# EAGLE design M709B (EAGLE 6.6.0)
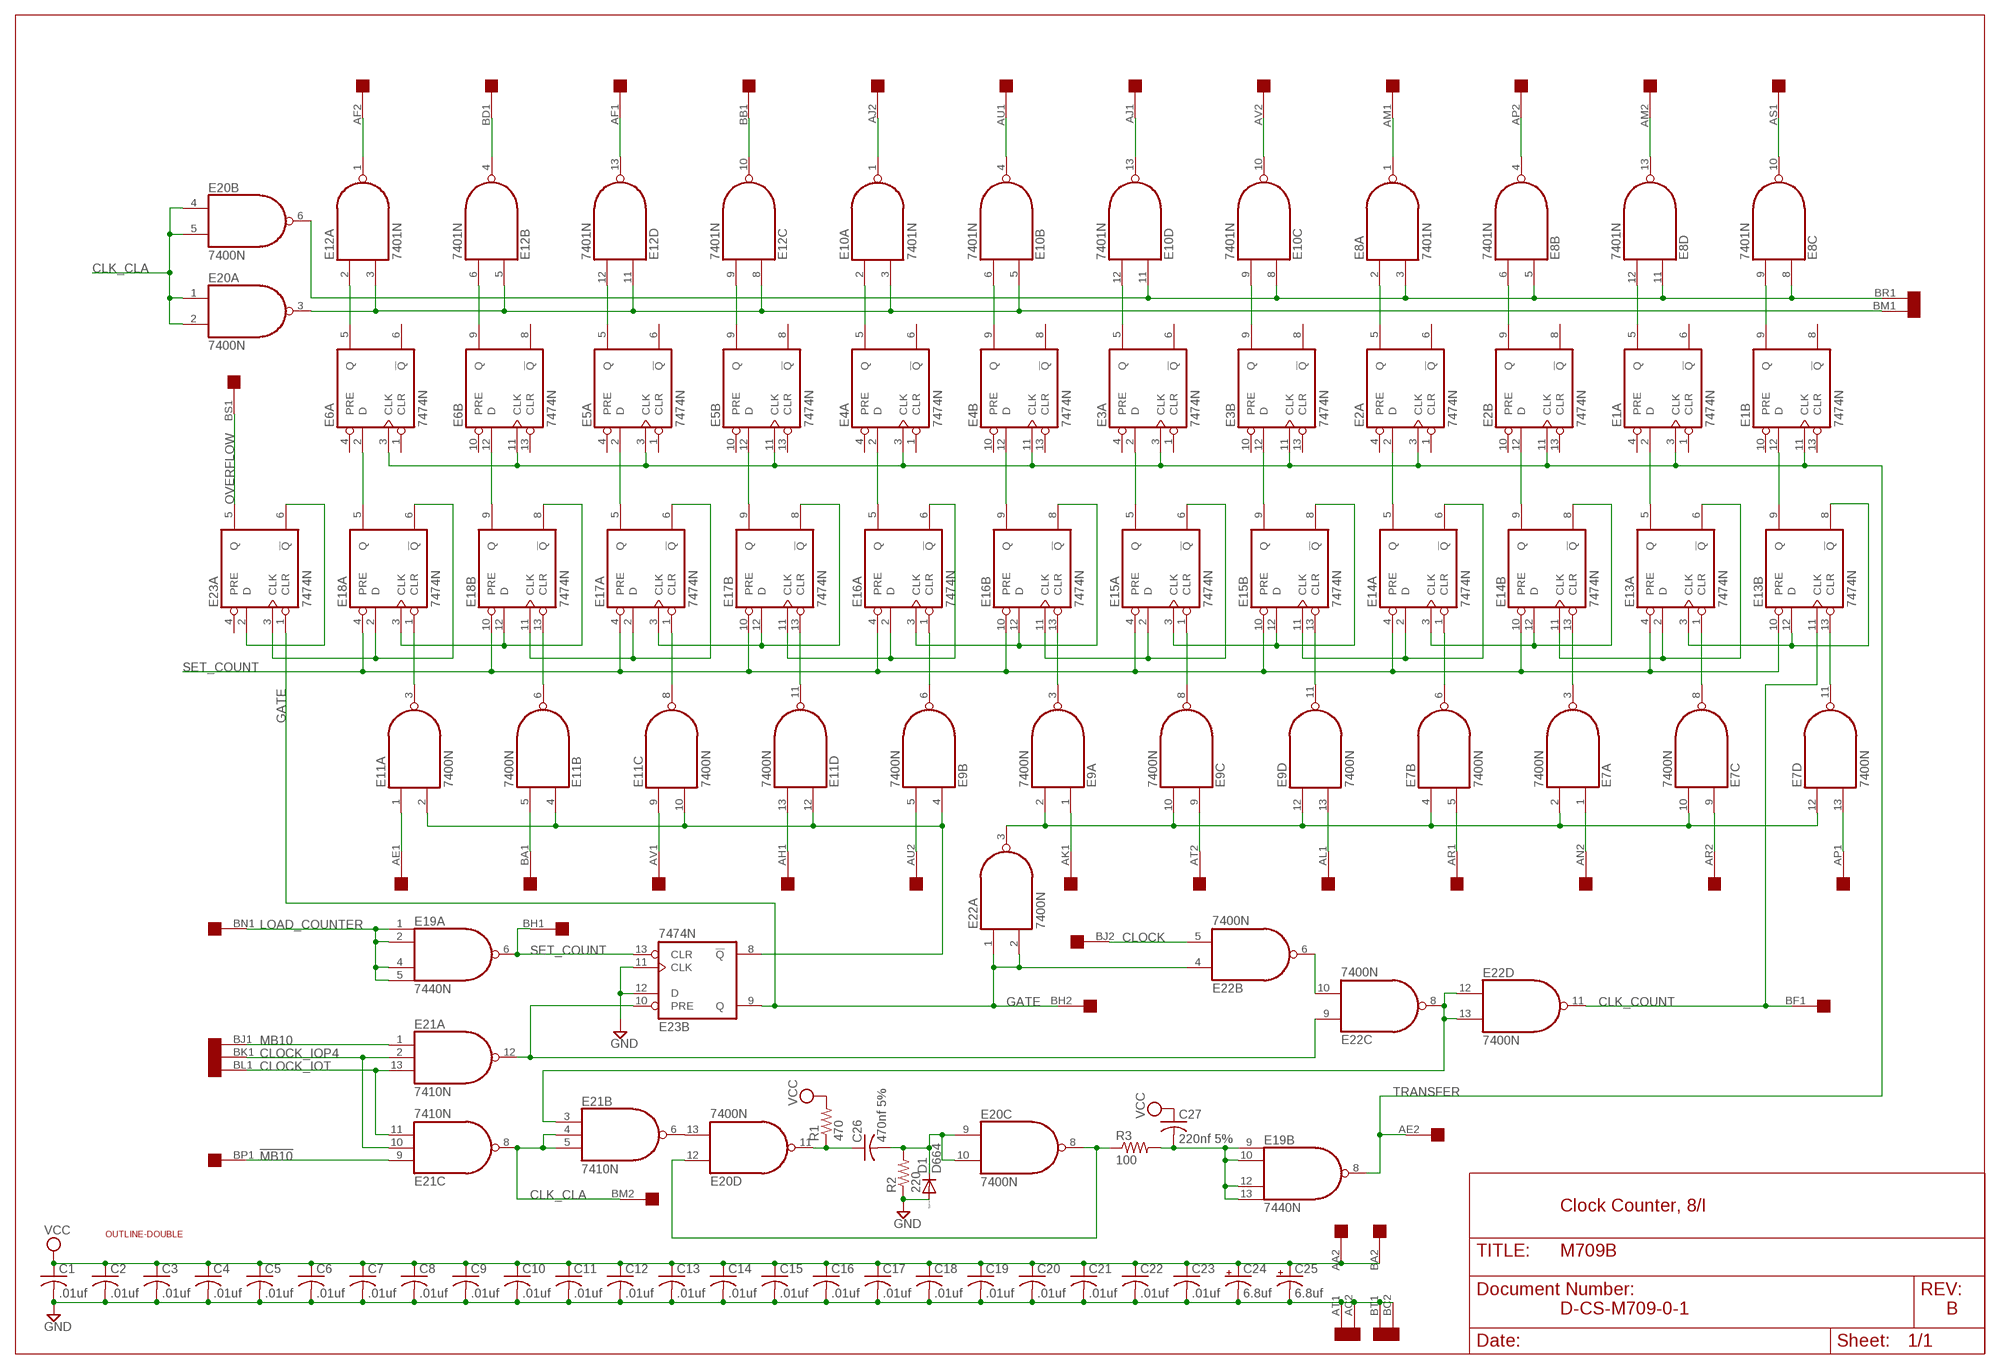
[diagram p0: schematic, sheet 1]

## Parts
C1  .01uf  C-US050-025X075  [C050-025X075]
C2  .01uf  C-US050-025X075  [C050-025X075]
C3  .01uf  C-US050-025X075  [C050-025X075]
C4  .01uf  C-US050-025X075  [C050-025X075]
C5  .01uf  C-US050-025X075  [C050-025X075]
C6  .01uf  C-US050-025X075  [C050-025X075]
C7  .01uf  C-US050-025X075  [C050-025X075]
C8  .01uf  C-US050-025X075  [C050-025X075]
C9  .01uf  C-US050-025X075  [C050-025X075]
C10  .01uf  C-US050-025X075  [C050-025X075]
C11  .01uf  C-US050-025X075  [C050-025X075]
C12  .01uf  C-US050-025X075  [C050-025X075]
C13  .01uf  C-US050-025X075  [C050-025X075]
C14  .01uf  C-US050-025X075  [C050-025X075]
C15  .01uf  C-US050-025X075  [C050-025X075]
C16  .01uf  C-US050-025X075  [C050-025X075]
C17  .01uf  C-US050-025X075  [C050-025X075]
C18  .01uf  C-US050-025X075  [C050-025X075]
C19  .01uf  C-US050-025X075  [C050-025X075]
C20  .01uf  C-US050-025X075  [C050-025X075]
C21  .01uf  C-US050-025X075  [C050-025X075]
C22  .01uf  C-US050-025X075  [C050-025X075]
C23  .01uf  C-US050-025X075  [C050-025X075]
C24  6.8uf  CPOL-USE15-5AXIAL  [E15-5]
C25  6.8uf  CPOL-USE15-5AXIAL  [E15-5]
C26  470nf 5%  C-US050-025X075  [C050-025X075]
C27  220nf 5%  C-US050-025X075  [C050-025X075]
D1  D664  1N4148DO35-10  [DO35-10]
E1  7474N  74S74N  [DIL14]
E2  7474N  74S74N  [DIL14]
E3  7474N  74S74N  [DIL14]
E4  7474N  74S74N  [DIL14]
E5  7474N  74S74N  [DIL14]
E6  7474N  74S74N  [DIL14]
E7  7400N  [DIL14]
E8  7401N  74LS01N  [DIL14]
E9  7400N  [DIL14]
E10  7401N  74LS01N  [DIL14]
E11  7400N  [DIL14]
E12  7401N  74LS01N  [DIL14]
E13  7474N  74S74N  [DIL14]
E14  7474N  74S74N  [DIL14]
E15  7474N  74S74N  [DIL14]
E16  7474N  74S74N  [DIL14]
E17  7474N  74S74N  [DIL14]
E18  7474N  74S74N  [DIL14]
E19  7440N  74S20N  [DIL14]
E20  7400N  [DIL14]
E21  7410N  [DIL14]
E22  7400N  [DIL14]
E23  7474N  74S74N  [DIL14]
R1  470  R-US_0207/10  [0207/10]
R2  220  R-US_0207/10  [0207/10]
R3  100  R-US_0207/10  [0207/10]
U$1  OUTLINE-DOUBLE  [DOUBLE]
U$2  DOUBLE  [EDGE-CON4]

## Nets
!MB10: E21.9(C:I0) U$2.BP1
CLK_CLA: E20.1(A:I0) E20.2(A:I1) E20.4(B:I0) E20.5(B:I1) E21.4(B:I1) E21.5(B:I2) E21.8(C:O) U$2.BM2
CLK_COUNT: E13.11(B:CLK) E22.11(D:O) U$2.BF1
CLOCK: E22.5(B:I1) U$2.BJ2
CLOCK_IOP4: E21.2(A:I1) E21.10(C:I1) U$2.BK1
CLOCK_IOT: E21.11(C:I2) E21.13(A:I2) U$2.BL1
GATE: E22.1(A:I0) E22.2(A:I1) E22.4(B:I0) E23.1(A:CLR) E23.9(B:Q) U$2.BH2
GND [Supply]: C1.2 C2.2 C3.2 C4.2 C5.2 C6.2 C7.2 C8.2 C9.2 C10.2 C11.2 C12.2 C13.2 C14.2 C15.2 C16.2 C17.2 C18.2 C19.2 C20.2 C21.2 C22.2 C23.2 C24.- C25.- D1.A E23.11(B:CLK) E23.12(B:D) R2.1 U$2.AC2 U$2.AT1 U$2.BC2 U$2.BT1
LOAD_COUNTER: E19.1(A:I0) E19.2(A:I1) E19.4(A:I2) E19.5(A:I3) U$2.BN1
MB10: E21.1(A:I0) U$2.BJ1
N$1: E1.9(B:Q) E8.9(C:I1)
N$2: E1.5(A:Q) E8.12(D:I1)
N$3: E2.9(B:Q) E8.6(B:I1)
N$4: E2.5(A:Q) E8.2(A:I0)
N$5: E6.5(A:Q) E12.2(A:I0)
N$6: E3.9(B:Q) E10.9(C:I1)
N$7: E3.5(A:Q) E10.12(D:I1)
N$8: E4.5(A:Q) E10.2(A:I0)
N$9: E4.9(B:Q) E10.6(B:I1)
N$10: E5.5(A:Q) E12.12(D:I1)
N$11: E5.9(B:Q) E12.9(C:I1)
N$12: E6.9(B:Q) E12.6(B:I1)
N$13: E10.3(A:I1) E10.5(B:I0) E12.3(A:I1) E12.5(B:I0) E12.8(C:I0) E12.11(D:I0) E20.3(A:O) U$2.BM1
N$14: E8.1(A:O) U$2.AM1
N$15: E8.4(B:O) U$2.AP2
N$16: E8.13(D:O) U$2.AM2
N$17: E8.10(C:O) U$2.AS1
N$18: E10.13(D:O) U$2.AJ1
N$19: E10.4(B:O) U$2.AU1
N$20: E10.1(A:O) U$2.AJ2
N$21: E10.10(C:O) U$2.AV2
N$22: E12.1(A:O) U$2.AF2
N$23: E12.4(B:O) U$2.BD1
N$24: E12.13(D:O) U$2.AF1
N$25: E12.10(C:O) U$2.BB1
N$27: E8.3(A:I1) E8.5(B:I0) E8.8(C:I0) E8.11(D:I0) E10.8(C:I0) E10.11(D:I0) E20.6(B:O) U$2.BR1
N$28: E6.2(A:D) E18.5(A:Q)
N$29: E6.12(B:D) E18.9(B:Q)
N$30: E5.2(A:D) E17.5(A:Q)
N$31: E5.12(B:D) E17.9(B:Q)
N$32: E4.2(A:D) E16.5(A:Q)
N$33: E4.12(B:D) E16.9(B:Q)
N$34: E3.2(A:D) E15.5(A:Q)
N$35: E3.12(B:D) E15.9(B:Q)
N$36: E2.2(A:D) E14.5(A:Q)
N$37: E2.12(B:D) E14.9(B:Q)
N$38: E1.2(A:D) E13.5(A:Q)
N$39: E1.12(B:D) E13.9(B:Q)
N$40: E13.3(A:CLK) E13.8(B:!Q) E13.12(B:D)
N$41: E13.2(A:D) E13.6(A:!Q) E14.11(B:CLK)
N$42: E14.3(A:CLK) E14.8(B:!Q) E14.12(B:D)
N$43: E14.2(A:D) E14.6(A:!Q) E15.11(B:CLK)
N$44: E15.3(A:CLK) E15.8(B:!Q) E15.12(B:D)
N$45: E15.2(A:D) E15.6(A:!Q) E16.11(B:CLK)
N$46: E16.3(A:CLK) E16.8(B:!Q) E16.12(B:D)
N$47: E16.2(A:D) E16.6(A:!Q) E17.11(B:CLK)
N$48: E17.3(A:CLK) E17.8(B:!Q) E17.12(B:D)
N$49: E17.2(A:D) E17.6(A:!Q) E18.11(B:CLK)
N$50: E18.3(A:CLK) E18.8(B:!Q) E18.12(B:D)
N$51: E18.2(A:D) E18.6(A:!Q) E23.3(A:CLK)
N$52: E23.2(A:D) E23.6(A:!Q)
N$53: E7.6(B:O) E14.1(A:CLR)
N$54: E7.3(A:O) E14.13(B:CLR)
N$55: E7.8(C:O) E13.1(A:CLR)
N$56: E7.11(D:O) E13.13(B:CLR)
N$57: E7.2(A:I1) E7.4(B:I0) E7.10(C:I1) E7.12(D:I0) E9.2(A:I1) E9.10(C:I1) E9.12(D:I0) E22.3(A:O)
N$58: E9.4(B:I0) E11.2(A:I1) E11.4(B:I0) E11.10(C:I1) E11.12(D:I0) E23.8(B:!Q)
N$59: E22.6(B:O) E22.10(C:I1)
N$60: E7.13(D:I1) U$2.AP1
N$61: E9.6(B:O) E16.1(A:CLR)
N$62: E9.3(A:O) E16.13(B:CLR)
N$63: E9.8(C:O) E15.1(A:CLR)
N$64: E9.11(D:O) E15.13(B:CLR)
N$65: E11.11(D:O) E17.13(B:CLR)
N$66: E11.8(C:O) E17.1(A:CLR)
N$67: E11.6(B:O) E18.13(B:CLR)
N$68: E11.3(A:O) E18.1(A:CLR)
N$69: E7.9(C:I0) U$2.AR2
N$70: E7.1(A:I0) U$2.AN2
N$71: E7.5(B:I1) U$2.AR1
N$72: E9.13(D:I1) U$2.AL1
N$73: E9.1(A:I0) U$2.AK1
N$74: E9.9(C:I0) U$2.AT2
N$75: E11.9(C:I0) U$2.AV1
N$76: E11.13(D:I1) U$2.AH1
N$77: E9.5(B:I1) U$2.AU2
N$78: E11.1(A:I0) U$2.AE1
N$79: E11.5(B:I1) U$2.BA1
N$81: E21.12(A:O) E22.9(C:I0) E23.10(B:PRE)
N$83: E21.3(B:I0) E22.8(C:O) E22.12(D:I0) E22.13(D:I1)
N$84: C26.2 D1.C E20.9(C:I0) E20.10(C:I1) R2.2
N$85: E20.13(D:I1) E21.6(B:O)
N$86: C27.2 E19.9(B:I0) E19.10(B:I1) E19.12(B:I2) E19.13(B:I3) R3.2
N$87: C26.1 E20.11(D:O) R1.1
N$89: E20.8(C:O) E20.12(D:I0) R3.1
OVERFLOW: E23.5(A:Q) U$2.BS1
SET_COUNT: E13.4(A:PRE) E13.10(B:PRE) E14.4(A:PRE) E14.10(B:PRE) E15.4(A:PRE) E15.10(B:PRE) E16.4(A:PRE) E16.10(B:PRE) E17.4(A:PRE) E17.10(B:PRE) E18.4(A:PRE) E18.10(B:PRE) E19.6(A:O) E23.13(B:CLR) U$2.BH1
TRANSFER: E1.3(A:CLK) E1.11(B:CLK) E2.3(A:CLK) E2.11(B:CLK) E3.3(A:CLK) E3.11(B:CLK) E4.3(A:CLK) E4.11(B:CLK) E5.3(A:CLK) E5.11(B:CLK) E6.3(A:CLK) E6.11(B:CLK) E19.8(B:O) U$2.AE2
VCC [Supply]: C1.1 C2.1 C3.1 C4.1 C5.1 C6.1 C7.1 C8.1 C9.1 C10.1 C11.1 C12.1 C13.1 C14.1 C15.1 C16.1 C17.1 C18.1 C19.1 C20.1 C21.1 C22.1 C23.1 C24.+ C25.+ C27.1 R1.2 U$2.AA2 U$2.BA2
Unconnected: E1.1(A:CLR) E1.4(A:PRE) E1.6(A:!Q) E1.8(B:!Q) E1.10(B:PRE) E1.13(B:CLR) E2.1(A:CLR) E2.4(A:PRE) E2.6(A:!Q) E2.8(B:!Q) E2.10(B:PRE) E2.13(B:CLR) E3.1(A:CLR) E3.4(A:PRE) E3.6(A:!Q) E3.8(B:!Q) E3.10(B:PRE) E3.13(B:CLR) E4.1(A:CLR) E4.4(A:PRE) E4.6(A:!Q) E4.8(B:!Q) E4.10(B:PRE) E4.13(B:CLR) E5.1(A:CLR) E5.4(A:PRE) E5.6(A:!Q) E5.8(B:!Q) E5.10(B:PRE) E5.13(B:CLR) E6.1(A:CLR) E6.4(A:PRE) E6.6(A:!Q) E6.8(B:!Q) E6.10(B:PRE) E6.13(B:CLR) E23.4(A:PRE) U$2.AA1 U$2.AB1 U$2.AB2 U$2.AC1 U$2.AD1 U$2.AD2 U$2.AH2 U$2.AK2 U$2.AL2 U$2.AN1 U$2.AS2 U$2.BB2 U$2.BC1 U$2.BD2 U$2.BE1 U$2.BE2 U$2.BF2 U$2.BK2 U$2.BL2 U$2.BN2 U$2.BP2 U$2.BR2 U$2.BS2 U$2.BT2 U$2.BU1 U$2.BU2 U$2.BV1 U$2.BV2

## Notes on the sheet
- Clock Counter, 8/I
- D-CS-M709-0-1 | B

## Power pins joined to a net without a drawn wire
GND: E1.7(P:GND) E2.7(P:GND) E3.7(P:GND) E4.7(P:GND) E5.7(P:GND) E6.7(P:GND) E7.7(P:GND) E8.7(P:GND) E9.7(P:GND) E10.7(P:GND) E11.7(P:GND) E12.7(P:GND) E13.7(P:GND) E14.7(P:GND) E15.7(P:GND) E16.7(P:GND) E17.7(P:GND) E18.7(P:GND) E19.7(P:GND) E20.7(P:GND) E21.7(P:GND) E22.7(P:GND) E23.7(P:GND)
VCC: E1.14(P:VCC) E2.14(P:VCC) E3.14(P:VCC) E4.14(P:VCC) E5.14(P:VCC) E6.14(P:VCC) E7.14(P:VCC) E8.14(P:VCC) E9.14(P:VCC) E10.14(P:VCC) E11.14(P:VCC) E12.14(P:VCC) E13.14(P:VCC) E14.14(P:VCC) E15.14(P:VCC) E16.14(P:VCC) E17.14(P:VCC) E18.14(P:VCC) E19.14(P:VCC) E20.14(P:VCC) E21.14(P:VCC) E22.14(P:VCC) E23.14(P:VCC)

## Library data of the parts
C1-C23 C26 C27 = rcl:C-US: CAPACITOR, American symbol
C24 C25 = rcl:CPOL-US: POLARIZED CAPACITOR, American symbol
D1 = diode:1N4148: DIODE high speed (Philips)
E1-E6 E13-E18 E23 = 74xx-us:74*74: Dual D type positive edge triggered FLIP FLOP, preset and clear
E7 E9 E11 E20 E22 = 74xx-us:74*00: Quad 2-input NAND gate
E8 E10 E12 = 74xx-us:74*01: Quad 2-input NAND gate, open collector
E19 = 74xx-us:74*20: Dual 4-input NAND gate
E21 = 74xx-us:74*10: Triple 3-input NAND gate
R1-R3 = rcl:R-US_: RESISTOR, American symbol
U$1 = dec-con:OUTLINE-*: Board outlines for DEC boards.
U$2 = dec-con:DOUBLE: Double-Height DEC board

## Net classes
0 default: width 0.406 mm
1 Supply: width 0.813 mm

## Board
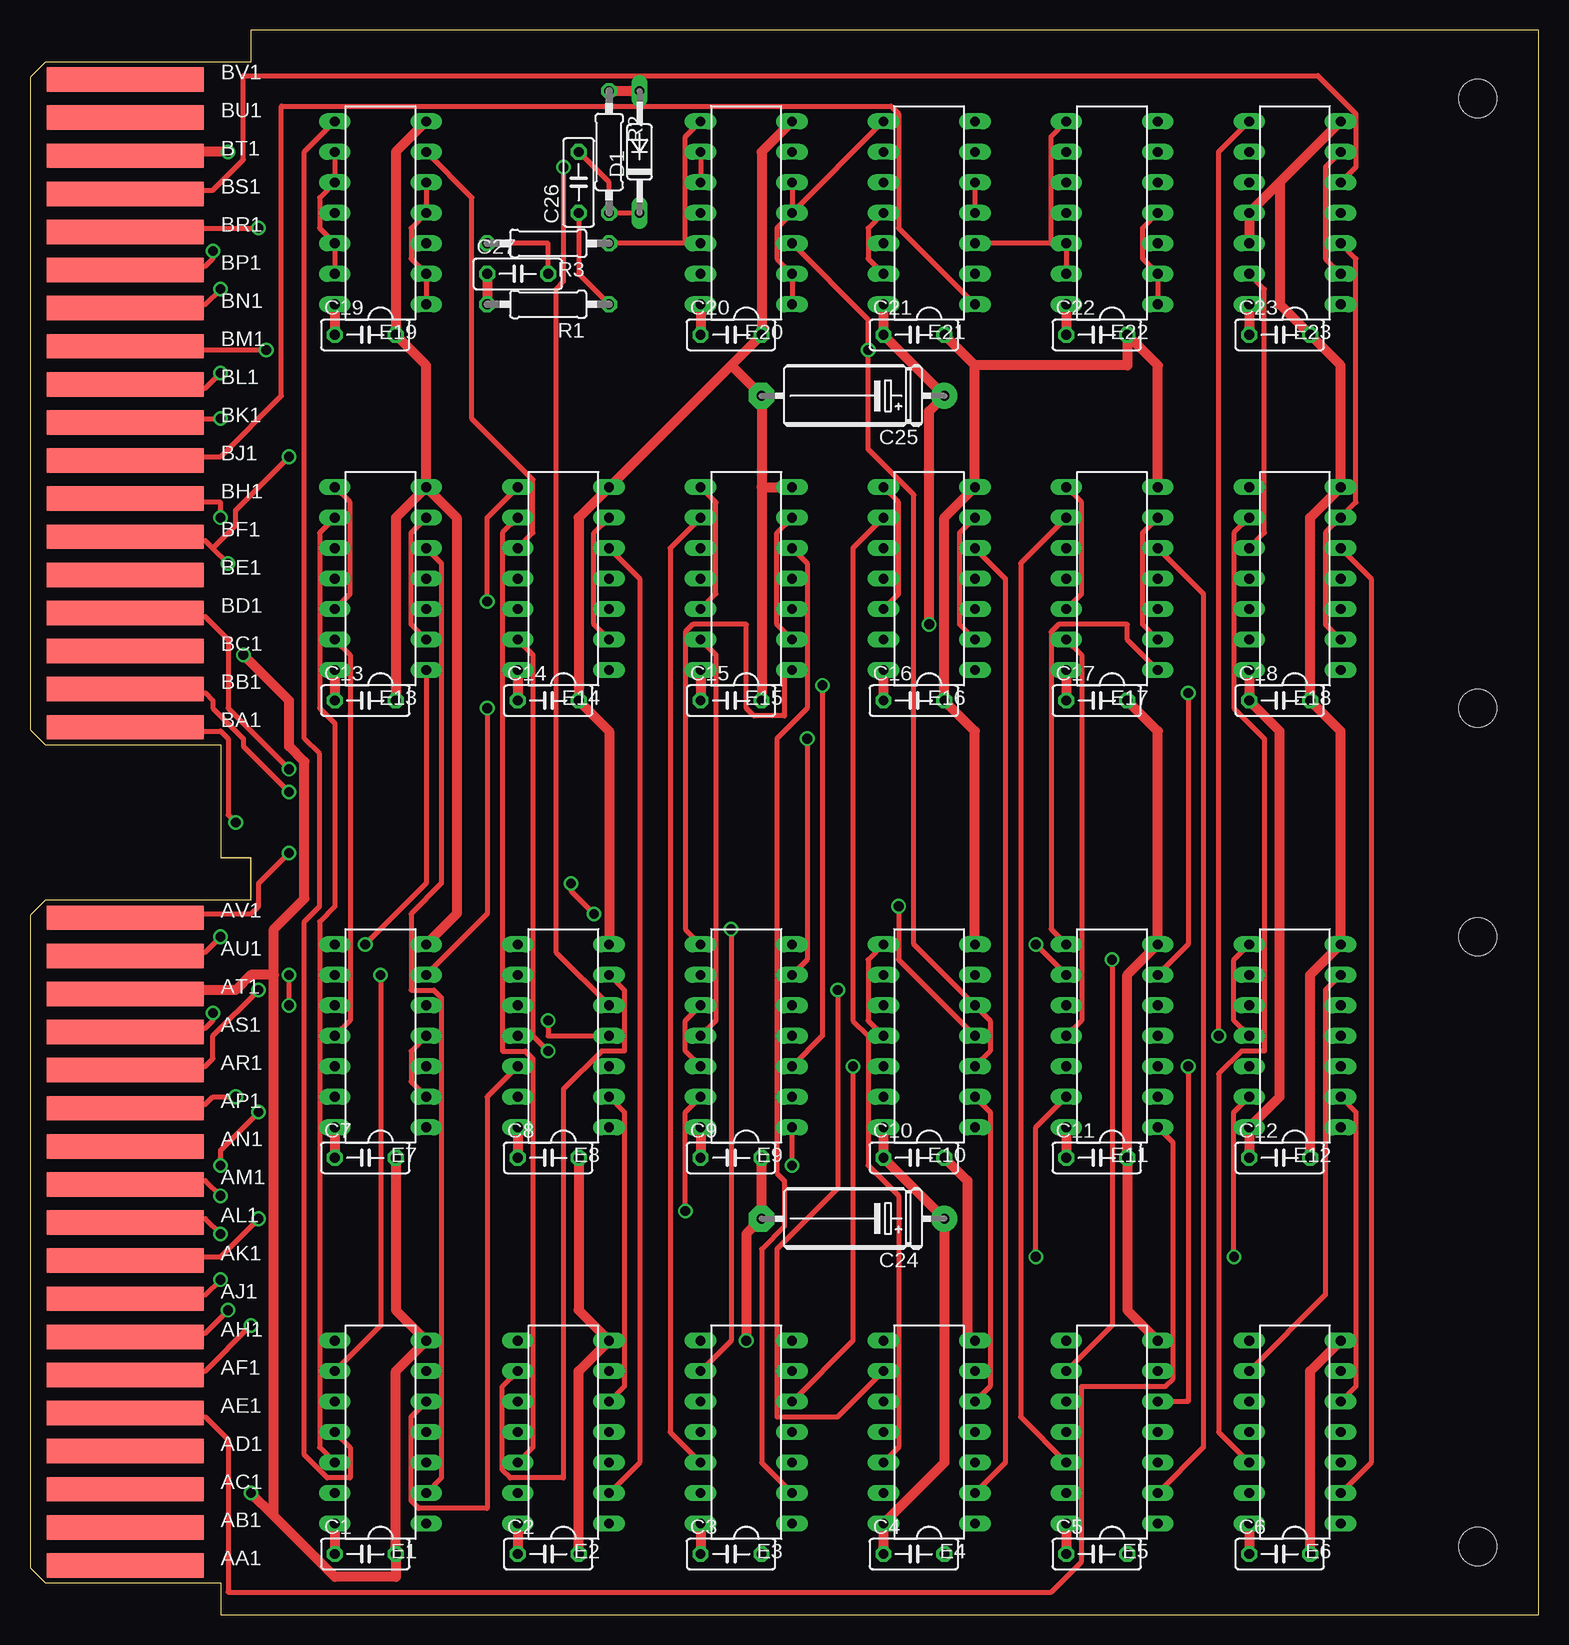
[diagram p1: board, top side]
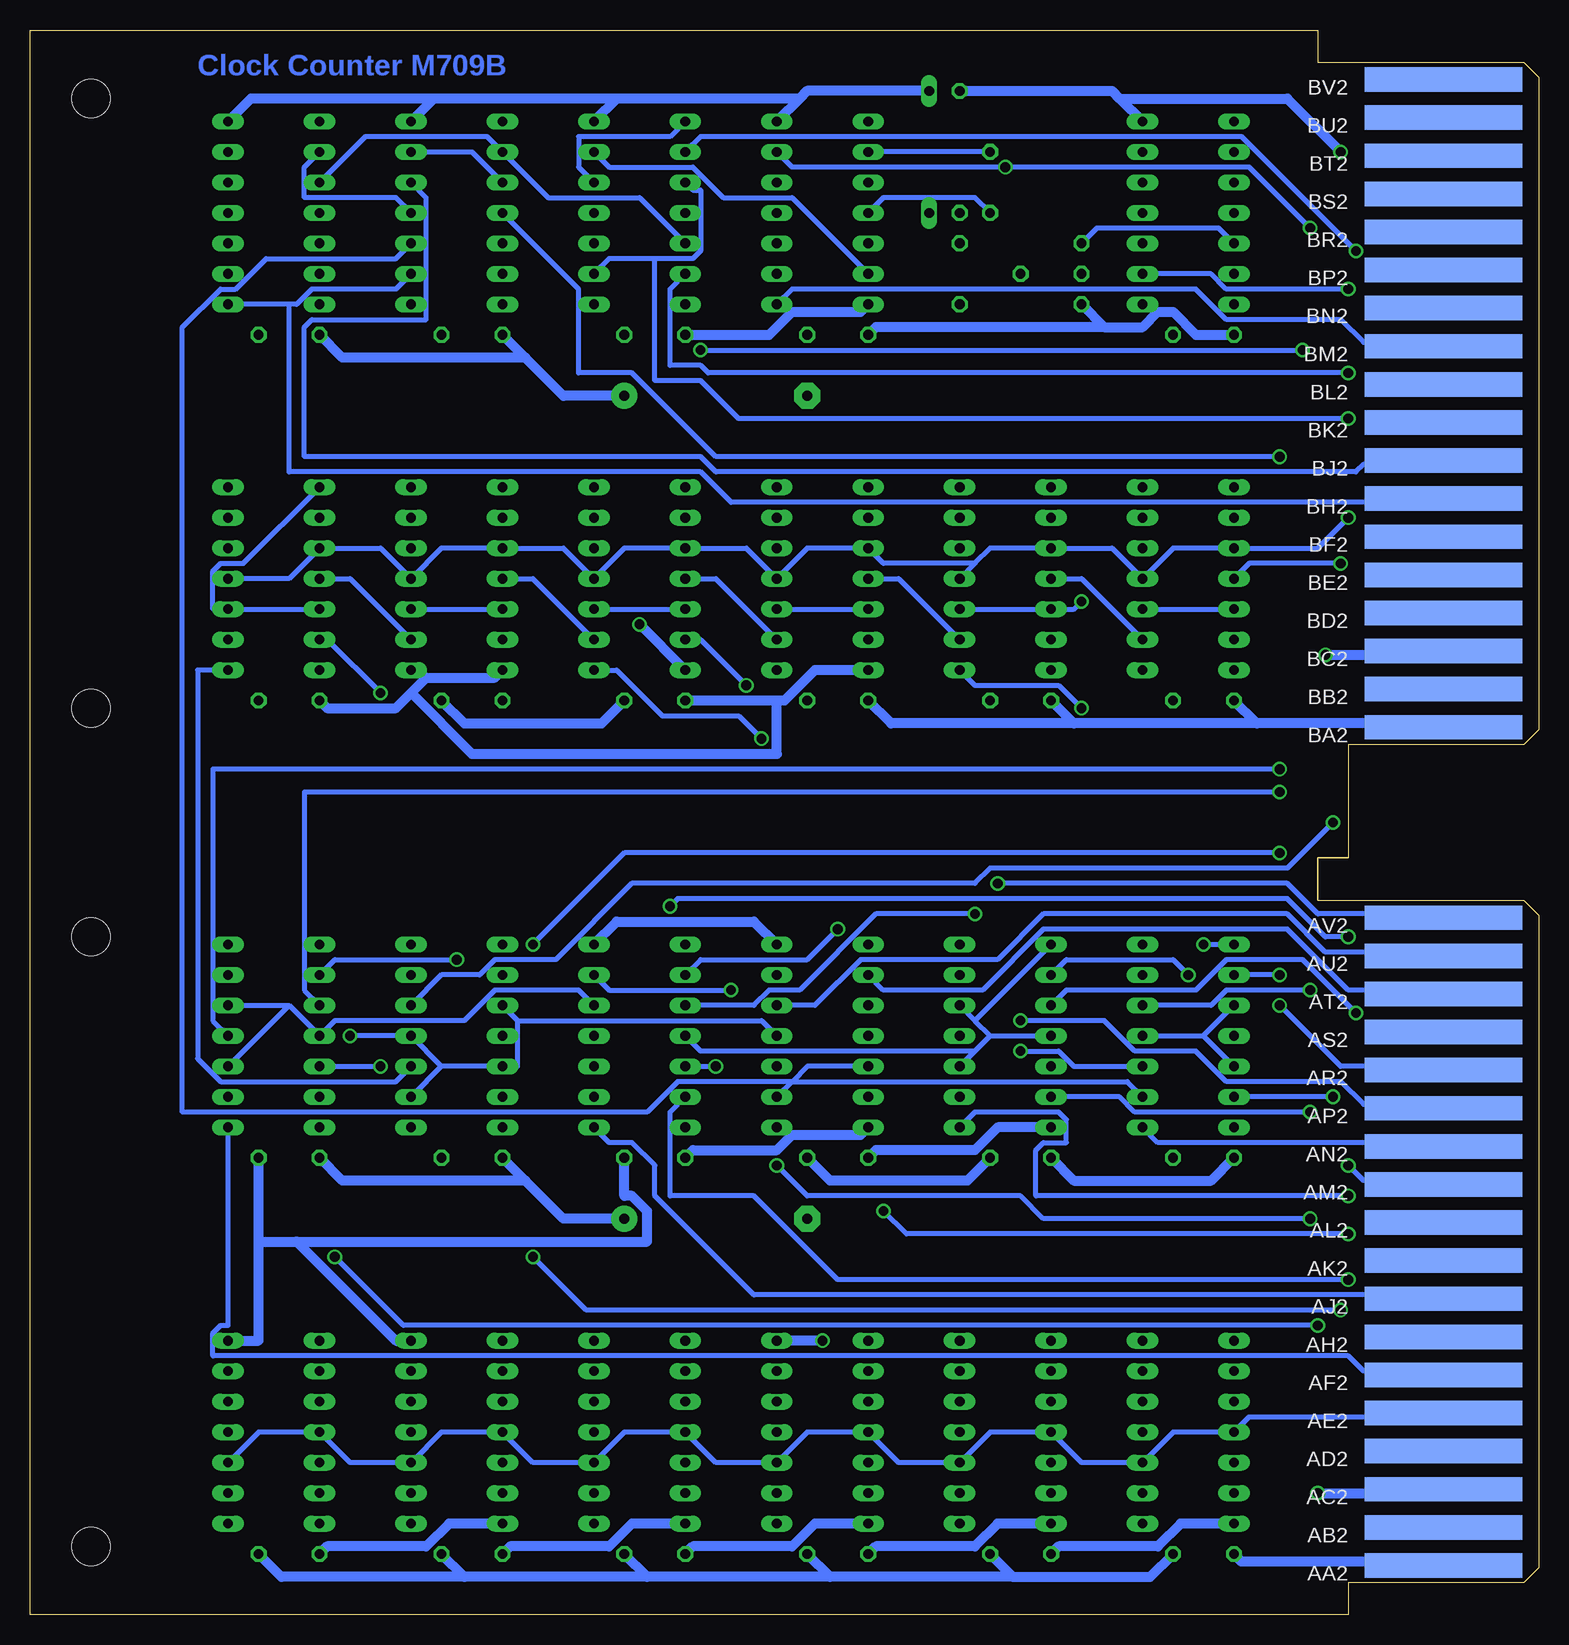
[diagram p2: board, bottom side, seen from below]

Size 125.73 x 132.08 mm. Coordinates in mm from the lower left corner, seen from the top.
Copper layers (1+16): Top 0.035mm / dielectric 1.5mm / Bottom 0.035mm
Design rules "16mils": minimum track width 16mil, minimum drill 32mil, track to track 15mil, track to pad 10mil, pad to pad 10mil, via to via 10mil, smd to smd 10mil, copper to edge 13mil, drill to drill 10mil, minimum pad ring 10mil, minimum via ring 8mil, stop-mask expansion 0mil, vias tented up to drill 0mil, thermal gap 10mil

### Footprints (pad centres in the part's own frame; a part is rotated, then mirrored left to right if it is on the bottom)
C050-025X075 = drill 0.813 octagon: 1 -2.54,0; 2 2.54,0
E15-5 = drill 0.813 pad 2.159: + -7.62,0 | drill 0.813 pad 2.159 octagon: - 7.62,0
DO35-10 = drill 0.813 long: A 5.08,0; C -5.08,0
DIL14 = drill 0.813 long: 1 -7.62,-3.81; 2 -5.08,-3.81; 3 -2.54,-3.81; 4 0,-3.81; 5 2.54,-3.81; 6 5.08,-3.81; 7 7.62,-3.81; 8 7.62,3.81; 9 5.08,3.81; 10 2.54,3.81; 11 0,3.81; 12 -2.54,3.81; 13 -5.08,3.81; 14 -7.62,3.81
0207/10 = drill 0.813 octagon: 1 -5.08,0; 2 5.08,0
DOUBLE = hole 3.175: 120.65,56.515; 120.65,5.715; 120.65,75.565; 120.65,126.365
EDGE-CON4 = smd 13.106 x 2.032: AA1 7.938,4.128; AB1 7.938,7.303; AC1 7.938,10.477; AD1 7.938,13.652; AE1 7.938,16.828; AF1 7.938,20.003; AH1 7.938,23.177; AJ1 7.938,26.352; AK1 7.938,29.527; AL1 7.938,32.703; AM1 7.938,35.877; AN1 7.938,39.053; AP1 7.938,42.227; AR1 7.938,45.403; AS1 7.938,48.578; AT1 7.938,51.752; AU1 7.938,54.928; AV1 7.938,58.102; BA1 7.938,73.978; BB1 7.938,77.153; BC1 7.938,80.328; BD1 7.938,83.502; BE1 7.938,86.677; BF1 7.938,89.853; BH1 7.938,93.028; BJ1 7.938,96.203; BK1 7.938,99.377; BL1 7.938,102.552; BM1 7.938,105.728; BN1 7.938,108.903; BP1 7.938,112.078; BR1 7.938,115.252; BS1 7.938,118.427; BT1 7.938,121.603; BU1 7.938,124.778; BV1 7.938,127.953 | smd 13.106 x 2.032 bottom: AA2 7.938,4.128; AB2 7.938,7.303; AC2 7.938,10.477; AD2 7.938,13.652; AE2 7.938,16.828; AF2 7.938,20.003; AH2 7.938,23.177; AJ2 7.938,26.352; AK2 7.938,29.527; AL2 7.938,32.703; AM2 7.938,35.877; AN2 7.938,39.053; AP2 7.938,42.227; AR2 7.938,45.403; AS2 7.938,48.578; AT2 7.938,51.752; AU2 7.938,54.928; AV2 7.938,58.102; BA2 7.938,73.978; BB2 7.938,77.153; BC2 7.938,80.328; BD2 7.938,83.502; BE2 7.938,86.677; BF2 7.938,89.853; BH2 7.938,93.028; BJ2 7.938,96.203; BK2 7.938,99.377; BL2 7.938,102.552; BM2 7.938,105.728; BN2 7.938,108.903; BP2 7.938,112.078; BR2 7.938,115.252; BS2 7.938,118.427; BT2 7.938,121.603; BU2 7.938,124.778; BV2 7.938,127.953

### Placement (x,y rotation side)
C1  27.94,5.08 0 top
C2  43.18,5.08 0 top
C3  58.42,5.08 0 top
C4  73.66,5.08 0 top
C5  88.9,5.08 0 top
C6  104.14,5.08 0 top
C7  27.94,38.1 0 top
C8  43.18,38.1 0 top
C9  58.42,38.1 0 top
C10  73.66,38.1 0 top
C11  88.9,38.1 0 top
C12  104.14,38.1 0 top
C13  27.94,76.2 0 top
C14  43.18,76.2 0 top
C15  58.42,76.2 0 top
C16  73.66,76.2 0 top
C17  88.9,76.2 0 top
C18  104.14,76.2 0 top
C19  27.94,106.68 0 top
C20  58.42,106.68 0 top
C21  73.66,106.68 0 top
C22  88.9,106.68 0 top
C23  104.14,106.68 0 top
C24  68.58,33.02 180 top
C25  68.58,101.6 180 top
C26  45.72,119.38 90 top
C27  40.64,111.76 0 top
D1  50.8,121.92 90 top
E1  29.21,15.24 90 top
E2  44.45,15.24 90 top
E3  59.69,15.24 90 top
E4  74.93,15.24 90 top
E5  90.17,15.24 90 top
E6  105.41,15.24 90 top
E7  29.21,48.26 90 top
E8  44.45,48.26 90 top
E9  59.69,48.26 90 top
E10  74.93,48.26 90 top
E11  90.17,48.26 90 top
E12  105.41,48.26 90 top
E13  29.21,86.36 90 top
E14  44.45,86.36 90 top
E15  59.69,86.36 90 top
E16  74.93,86.36 90 top
E17  90.17,86.36 90 top
E18  105.41,86.36 90 top
E19  29.21,116.84 90 top
E20  59.69,116.84 90 top
E21  74.93,116.84 90 top
E22  90.17,116.84 90 top
E23  105.41,116.84 90 top
R1  43.18,109.22 180 top
R2  48.26,121.92 270 top
R3  43.18,114.3 180 top
U$1  0,0 0 top
U$2  0,0 0 top

### Tracks (layer width: path | path; a pad name or v marks a point on that pad's centre or on a via)
!MB10  (via drill 0.81)
  Top 0.406: v15.24,113.67 15.24,113.03 14.61,112.39 8.26,112.39 U$2.BP1
  Bottom 0.406: E21.9 69.85,123.19 24.77,123.19 v15.24,113.67
CLK_CLA
  Top 0.406: E21.5 E21.4 | E20.1 E20.2 62.23,113.03 62.23,115.57 E20.4 | E20.5 E20.4 | E20.4 E21.8
  Bottom 0.406: E21.5 80.01,120.65 80.01,123.19 72.39,123.19 E21.8 | E20.1 62.23,110.49 28.58,110.49 26.04,107.95 16.51,107.95 14.61,106.05 8.26,106.05 U$2.BM2
CLK_COUNT  (via drill 0.81)
  Top 0.406: 15.24,88.9 14.61,89.53 8.26,89.53 U$2.BF1 | 15.24,88.9 v16.51,87.63 | v21.59,96.52 17.15,92.08 17.15,90.81 15.24,88.9
  Bottom 0.406: E13.11 24.13,87.63 v16.51,87.63 | E22.11 80.01,110.49 80.01,103.5 75.57,103.5 68.58,96.52 v21.59,96.52
CLOCK
  Bottom 0.406: E22.5 92.71,118.11 92.71,107.95 102.24,107.95 102.87,107.31 102.87,96.52 69.85,96.52 68.58,95.25 15.24,95.25 14.61,95.89 8.26,95.89 U$2.BJ2
CLOCK_IOP4  (via drill 0.81)
  Top 0.406: v15.88,99.69 8.26,99.69 U$2.BK1
  Bottom 0.406: E21.2 77.47,113.03 73.66,113.03 | 73.66,113.03 70.49,113.03 69.85,113.67 69.85,118.75 70.49,118.75 E21.10 | 73.66,113.03 73.66,102.87 69.85,102.87 66.68,99.69 v15.88,99.69
CLOCK_IOT  (via drill 0.81)
  Top 0.406: E21.13 69.85,113.03 69.85,115.57 E21.11 | v15.88,103.5 14.61,102.23 8.26,102.23 U$2.BL1
  Bottom 0.406: E21.13 72.39,110.49 72.39,104.14 69.85,104.14 69.22,103.5 v15.88,103.5
GATE
  Top 0.406: E22.1 E22.2 92.71,113.03 92.71,115.57 E22.4
  Bottom 0.406: 104.14,109.22 103.51,109.22 102.24,110.49 95.25,110.49 E22.2 | 104.14,109.22 E23.1 | E23.9 102.87,120.65 102.87,118.11 95.25,118.11 E22.4 | 104.14,109.22 104.14,95.25 69.85,95.25 67.31,92.71 8.26,92.71 U$2.BH2
GND  (via drill 0.81)
  Top 0.813: 60.96,93.98 C25.- 58.42,104.14 | 60.96,93.98 C15.2 | 60.96,93.98 E15.7 | E8.7 48.26,73.66 C14.2 45.72,91.44 E14.7 58.42,104.14 | 58.42,104.14 C20.2 60.96,121.92 E20.7 | E7.7 35.56,58.42 35.56,91.44 E13.7 | C13.2 30.48,91.44 E13.7 | E13.7 33.02,104.14 C19.2 30.48,121.92 E19.7 | E23.12 E23.11 104.14,119.38 | 104.14,119.38 E23.7 | 104.14,119.38 104.14,109.22 C23.2 109.22,104.14 E18.7 106.68,91.44 C18.2 109.22,73.66 E12.7 106.68,53.34 C12.2 | R2.1 D1.A | v16.51,121.92 8.26,121.92 U$2.BT1 | 78.74,104.14 C21.2 | 78.74,104.14 E16.7 76.2,91.44 C16.2 78.74,73.66 E10.7 | E17.7 93.98,104.14 C22.2 91.44,104.14 78.74,104.14 | E5.7 91.44,25.4 C11.2 91.44,53.34 E11.7 93.98,73.66 C17.2 | v59.69,22.86 59.69,31.75 C24.- C9.2 | E4.7 78.11,23.5 78.11,36.2 C10.2 | C8.2 45.72,25.4 E2.7 45.72,20.32 C2.2 | C7.2 30.48,25.4 E1.7 30.48,20.32 C1.2 30.48,3.17 25.4,3.17 20.32,8.26 | E6.7 106.68,20.32 C6.2 | 20.32,8.26 v18.42,10.16 | 20.32,53.34 18.42,53.34 17.15,52.07 8.26,52.07 U$2.AT1 | 20.32,8.26 20.32,53.34 | v17.78,80.01 21.59,76.2 21.59,72.39 22.86,71.12 22.86,59.69 20.32,57.15 20.32,53.34
  Bottom 0.813: 34.93,126.36 35.56,127 R2.1 | 34.93,126.36 E19.7 | 61.6,126.36 60.96,127 D1.A | 61.6,126.36 E20.7 | 76.84,126.36 E21.7 | 61.6,126.36 76.84,126.36 | 92.08,126.36 E22.7 | 76.84,126.36 92.08,126.36 | v16.51,121.92 20.96,126.36 34.93,126.36 | E23.7 107.32,126.36 92.08,126.36 | E9.7 65.41,57.78 76.84,57.78 E10.7 | v59.69,22.86 E3.7 | C1.2 32.39,3.17 43.82,3.17 | C2.2 43.82,3.17 | 59.06,3.17 C3.2 | 43.82,3.17 59.06,3.17 | 74.3,3.17 C4.2 | 59.06,3.17 74.3,3.17 | 89.54,3.17 C5.2 | 74.3,3.17 89.54,3.17 | C6.2 104.78,3.17 89.54,3.17 | 106.68,31.11 106.68,22.86 E6.7 | 106.68,31.11 C12.2 | C10.2 76.2,34.92 75.57,34.92 74.3,33.66 74.3,31.11 103.51,31.11 | 106.68,31.11 103.51,31.11 | C9.2 59.06,36.2 47.63,36.2 C8.2 | v18.42,10.16 8.26,10.16 U$2.AC2 | v17.78,80.01 8.26,80.01 U$2.BC2 | E5.7 95.25,22.86 103.51,31.11 | C16.2 78.11,74.3 89.54,74.3 C17.2
LOAD_COUNTER  (via drill 0.81)
  Top 0.406: E19.1 E19.2 31.75,113.03 31.75,115.57 E19.4 E19.5 | v15.88,110.49 14.61,109.22 8.26,109.22 U$2.BN1
  Bottom 0.406: E19.2 27.31,111.76 26.04,110.49 v15.88,110.49
MB10
  Top 0.406: E21.1 72.39,115.57 72.39,125.09 71.76,125.73 20.96,125.73 20.96,101.6 15.88,96.52 8.26,96.52 U$2.BJ1
N$1  (via drill 0.81)
  Top 0.406: E1.9 29.21,24.13 v29.21,53.34
  Bottom 0.406: v29.21,53.34 30.48,54.61 39.37,54.61 E8.9
N$2
  Top 0.406: E1.5 31.75,16.51 31.75,9.53 32.39,8.89 38.1,8.89 38.1,43.18 E8.12
N$3
  Top 0.406: E2.9 39.37,19.05 39.37,12.06 40.01,11.43 44.45,11.43 44.45,43.81 47.63,46.99 49.53,46.99 49.53,52.07 E8.6
N$4
  Top 0.406: E2.5 49.53,19.05 49.53,41.91 E8.2
N$5
  Top 0.406: E6.5 110.49,19.05 110.49,41.91 E12.2
N$6  (via drill 0.81)
  Top 0.406: E3.9 58.42,22.86 v58.42,57.15
  Bottom 0.406: v58.42,57.15 60.96,54.61 69.85,54.61 E10.9
N$7  (via drill 0.81)
  Top 0.406: E3.5 68.58,22.86 v68.58,45.72
  Bottom 0.406: E10.12 v68.58,45.72
N$8
  Top 0.406: E4.5 80.01,19.05 80.01,41.91 E10.2
N$9  (via drill 0.81)
  Top 0.406: E4.9 67.31,16.51 62.23,16.51 62.23,30.48 67.31,35.56 v67.31,52.07
  Bottom 0.406: v67.31,52.07 77.47,52.07 E10.6
N$10  (via drill 0.81)
  Top 0.406: E5.5 96.52,17.78 v96.52,45.72
  Bottom 0.406: E12.12 v96.52,45.72
N$11  (via drill 0.81)
  Top 0.406: E5.9 90.17,24.13 v90.17,54.61
  Bottom 0.406: v90.17,54.61 100.33,54.61 E12.9
N$12
  Top 0.406: E6.9 107.95,26.67 107.95,52.07 E12.6
N$13  (via drill 0.81)
  Top 0.406: E12.8 100.33,54.61 100.33,49.53 E12.11 | E10.3 80.01,46.99 80.01,49.53 E10.5 73.66,55.88 73.66,93.34 69.85,97.16 v69.85,105.41 69.85,107.95 E20.3 | v19.69,105.41 8.26,105.41 U$2.BM1
  Bottom 0.406: 104.14,50.8 E12.11 100.33,49.53 89.54,49.53 87,52.07 80.01,52.07 E10.5 | E12.5 104.14,50.8 | 104.14,50.8 E12.3 | v69.85,105.41 v19.69,105.41
N$14  (via drill 0.81)
  Top 0.406: v15.88,34.92 14.61,36.2 8.26,36.2 U$2.AM1
  Bottom 0.406: E8.1 46.99,41.91 40.01,41.91 39.37,41.27 39.37,39.37 41.28,39.37 41.91,38.73 41.91,34.92 v15.88,34.92
N$15  (via drill 0.81)
  Top 0.406: E8.4 43.18,48.26 v43.18,49.53
  Bottom 0.406: v43.18,49.53 36.2,49.53 33.66,46.99 28.58,46.99 26.04,44.45 16.51,44.45 14.61,42.55 8.26,42.55 U$2.AP2
N$16  (via drill 0.81)
  Top 0.406: v19.05,41.91 15.88,38.73 v15.88,37.47
  Bottom 0.406: E8.13 34.93,43.18 33.66,41.91 v19.05,41.91 | v15.88,37.47 14.61,36.2 8.26,36.2 U$2.AM2
N$17  (via drill 0.81)
  Top 0.406: v15.24,50.16 15.24,49.53 14.61,48.9 8.26,48.9 U$2.AS1
  Bottom 0.406: E8.10 39.37,52.07 28.58,52.07 26.04,54.61 19.69,54.61 v15.24,50.16
N$18  (via drill 0.81)
  Top 0.406: v15.88,27.94 14.61,26.67 8.26,26.67 U$2.AJ1
  Bottom 0.406: E10.13 72.39,41.91 72.39,34.92 65.41,34.92 58.42,27.94 v15.88,27.94
N$19  (via drill 0.81)
  Top 0.406: E10.4 72.39,54.61 v72.39,59.05 | v15.88,56.52 14.61,55.24 8.26,55.24 U$2.AU1
  Bottom 0.406: v72.39,59.05 71.76,59.69 20.96,59.69 17.78,56.52 v15.88,56.52
N$20
  Bottom 0.406: E10.1 77.47,39.37 75.57,39.37 73.66,37.47 73.66,34.92 65.41,26.67 8.26,26.67 U$2.AJ2
N$21  (via drill 0.81)
  Top 0.406: v46.99,58.42 45.09,60.33 v45.09,60.96
  Bottom 0.406: E10.10 65.41,50.8 64.14,52.07 61.6,52.07 55.25,58.42 v46.99,58.42 | v45.09,60.96 20.96,60.96 18.42,58.42 8.26,58.42 U$2.AV2
N$22
  Bottom 0.406: E12.1 109.22,24.13 109.86,24.13 110.49,23.5 110.49,21.59 15.88,21.59 14.61,20.32 8.26,20.32 U$2.AF2
N$23  (via drill 0.81)
  Top 0.406: v21.59,70.48 16.51,75.56 16.51,81.28 14.61,83.19 8.26,83.19 U$2.BD1
  Bottom 0.406: E12.4 110.49,49.53 110.49,70.48 v21.59,70.48
N$24  (via drill 0.81)
  Top 0.406: E12.13 100.33,41.91 v100.33,29.84 | v18.42,24.13 14.61,20.32 8.26,20.32 U$2.AF1
  Bottom 0.406: v100.33,29.84 94.62,24.13 v18.42,24.13
N$25  (via drill 0.81)
  Top 0.406: v21.59,68.58 17.78,72.39 17.78,73.03 15.24,75.56 15.24,76.2 14.61,76.83 8.26,76.83 U$2.BB1
  Bottom 0.406: E12.10 102.87,52.07 102.87,68.58 v21.59,68.58
N$27  (via drill 0.81)
  Top 0.406: E10.11 69.85,49.53 69.85,54.61 E10.8 | v19.05,115.57 8.26,115.57 U$2.BR1 | E8.5 43.82,55.24 43.82,110.49 44.45,111.12 v44.45,120.65
  Bottom 0.406: 45.72,48.26 E8.11 | E8.5 46.99,49.53 | 46.99,49.53 45.72,48.26 | 45.72,48.26 46.99,46.99 | 46.99,46.99 E8.3 | 46.99,49.53 E8.8 | E10.11 69.85,46.99 46.99,46.99 | E20.6 62.23,120.65 v44.45,120.65 24.13,120.65 v19.05,115.57
N$28
  Top 0.406: E6.2 111.76,12.7 111.76,86.36 E18.5
N$29
  Top 0.406: E6.12 99.06,15.24 99.06,45.09 100.97,46.99 102.87,46.99 102.87,73.03 100.33,75.56 100.33,90.17 E18.9
N$30
  Top 0.406: E5.2 97.79,13.97 97.79,85.09 E17.5
N$31
  Top 0.406: E5.12 82.55,16.51 82.55,87.63 E17.9
N$32
  Top 0.406: E4.2 81.28,12.7 81.28,86.36 E16.5
N$33
  Top 0.406: E4.12 72.39,13.97 72.39,34.92 69.85,37.47 69.85,48.26 68.58,49.53 68.58,88.9 E16.9
N$34
  Top 0.406: E3.2 60.96,12.7 60.96,30.48 62.87,32.38 62.87,36.2 62.23,36.83 62.23,73.03 64.77,75.56 64.77,87.63 E15.5
N$35
  Top 0.406: E3.12 53.34,15.24 53.34,88.9 E15.9
N$36
  Top 0.406: E2.2 50.8,12.7 50.8,86.36 E14.5
N$37
  Top 0.406: E2.12 41.91,13.97 41.91,46.35 41.28,46.99 39.37,46.99 39.37,90.17 E14.9
N$38
  Top 0.406: E1.2 34.29,11.43 34.29,51.44 33.66,52.07 31.75,52.07 31.75,58.42 34.29,60.96 34.29,87.63 E13.5
N$39
  Top 0.406: E1.12 24.13,13.97 24.13,57.78 25.4,59.05 25.4,74.3 24.13,75.56 24.13,90.17 E13.9
N$40
  Top 0.406: E13.8 26.67,92.71 26.67,85.09 E13.12
  Bottom 0.406: E13.3 E13.12
N$41
  Top 0.406: E13.6 31.75,90.17 31.75,82.55 E13.2
  Bottom 0.406: E13.2 38.1,86.36 E14.11
N$42  (via drill 0.81)
  Top 0.406: E14.8 38.1,91.44 v38.1,84.45
  Bottom 0.406: E14.3 E14.12 38.74,83.82 v38.1,84.45
N$43
  Top 0.406: E14.6 46.99,90.17 46.99,82.55 E14.2
  Bottom 0.406: E14.2 53.34,86.36 E15.11
N$44
  Top 0.406: E15.8 57.15,92.71 57.15,85.09 E15.12
  Bottom 0.406: E15.3 E15.12
N$45
  Top 0.406: E15.6 62.23,90.17 62.23,82.55 E15.2
  Bottom 0.406: E15.2 68.58,86.36 E16.11
N$46
  Top 0.406: E16.8 72.39,92.71 72.39,85.09 E16.12
  Bottom 0.406: E16.3 E16.12
N$47
  Top 0.406: E16.6 77.47,90.17 77.47,82.55 E16.2
  Bottom 0.406: E16.2 83.82,86.36 E17.11
N$48
  Top 0.406: E17.8 87.63,92.71 87.63,85.09 E17.12
  Bottom 0.406: E17.3 E17.12
N$49
  Top 0.406: E17.6 92.71,90.17 92.71,82.55 E17.2
  Bottom 0.406: E17.2 99.06,86.36 E18.11
N$50
  Bottom 0.406: E18.12 E18.3 110.49,83.82 110.49,87 109.86,87.63 107.95,87.63 E18.8
N$51
  Top 0.406: E18.2 107.95,82.55 107.95,90.17 E18.6 110.49,92.71 110.49,113.03 E23.3
N$52
  Top 0.406: E23.2 107.95,113.03 107.95,120.65 E23.6
N$53  (via drill 0.81)
  Top 0.406: E7.6 38.1,58.42 v38.1,75.56
  Bottom 0.406: v38.1,75.56 40.01,77.47 46.99,77.47 E14.1
N$54  (via drill 0.81)
  Top 0.406: v43.18,46.99 41.91,48.26 41.91,80.01 E14.13
  Bottom 0.406: E7.3 38.74,45.72 40.01,46.99 v43.18,46.99
N$55  (via drill 0.81)
  Top 0.406: v27.94,55.88 33.02,60.96 E13.1
  Bottom 0.406: v27.94,55.88 E7.8
N$56
  Top 0.406: E7.11 26.67,49.53 26.67,80.01 E13.13
N$57
  Top 0.406: E7.2 31.75,44.45 31.75,46.99 E7.4 | E9.10 54.61,49.53 54.61,46.99 E9.12
  Bottom 0.406: 27.94,48.26 E7.12 | E7.4 27.94,48.26 | 27.94,48.26 E7.10 | 62.23,44.45 60.96,45.72 E9.12 | 62.23,44.45 E9.2 | E22.3 95.25,113.03 106.05,113.03 108.59,110.49 109.86,110.49 113.03,107.31 113.03,41.91 74.3,41.91 71.76,44.45 62.23,44.45 | E7.2 34.29,44.45 62.23,44.45
N$58  (via drill 0.81)
  Top 0.406: E23.8 99.06,121.92 v99.06,48.26
  Bottom 0.406: E9.4 64.77,49.53 85.09,49.53 | E11.10 85.09,49.53 | 91.44,45.72 E11.2 | 91.44,45.72 E11.12 85.09,45.72 85.09,49.53 | 91.44,45.72 E11.4 v99.06,48.26
N$59
  Bottom 0.406: E22.10 88.9,121.92 E22.6
N$60  (via drill 0.81)
  Top 0.406: v17.15,43.18 15.24,43.18 14.61,42.55 8.26,42.55 U$2.AP1
  Bottom 0.406: v17.15,43.18 E7.13
N$61  (via drill 0.81)
  Top 0.406: E9.6 64.77,54.61 v64.77,73.03
  Bottom 0.406: v64.77,73.03 66.68,74.93 73.03,74.93 76.84,78.74 E16.1
N$62  (via drill 0.81)
  Top 0.406: E9.3 66.04,48.26 v66.04,77.47
  Bottom 0.406: v66.04,77.47 69.85,81.28 E16.13
N$63
  Top 0.406: E9.8 54.61,57.15 54.61,81.92 55.25,82.55 59.69,82.55 59.69,75.56 60.33,74.93 62.87,74.93 62.87,78.11 E15.1
N$64
  Top 0.406: E9.11 57.15,49.53 57.15,80.01 E15.13
N$65
  Top 0.406: E11.11 87.63,49.53 87.63,80.01 E17.13
N$66
  Top 0.406: E11.8 85.09,57.15 85.09,81.92 85.73,82.55 91.44,82.55 91.44,81.28 E17.1
N$67  (via drill 0.81)
  Top 0.406: E11.6 96.52,55.88 v96.52,76.83
  Bottom 0.406: v96.52,76.83 100.97,81.28 E18.13
N$68
  Bottom 0.406: E11.3 95.25,44.45 109.86,44.45 111.76,46.35 111.76,78.74 E18.1
N$69  (via drill 0.81)
  Top 0.406: v21.59,50.8 v21.59,53.34
  Bottom 0.406: v21.59,53.34 E7.9 | v21.59,50.8 16.51,45.72 8.26,45.72 U$2.AR2
N$70
  Bottom 0.406: E7.1 31.75,39.37 8.26,39.37 U$2.AN2
N$71  (via drill 0.81)
  Top 0.406: v19.05,52.07 15.24,48.26 15.24,46.35 14.61,45.72 8.26,45.72 U$2.AR1
  Bottom 0.406: E7.5 27.31,50.8 26.04,52.07 v19.05,52.07
N$72  (via drill 0.81)
  Top 0.406: E9.13 54.61,41.91 v54.61,33.66 | v15.88,31.75 14.61,33.02 8.26,33.02 U$2.AL1
  Bottom 0.406: v54.61,33.66 52.71,31.75 v15.88,31.75
N$73  (via drill 0.81)
  Top 0.406: v63.5,37.47 E9.1 | v19.05,33.02 15.88,29.84 8.26,29.84 U$2.AK1
  Bottom 0.406: v63.5,37.47 60.96,34.92 43.18,34.92 41.28,33.02 v19.05,33.02
N$74
  Bottom 0.406: E9.9 54.61,52.07 46.36,52.07 41.28,57.15 20.96,57.15 15.88,52.07 8.26,52.07 U$2.AT2
N$75  (via drill 0.81)
  Top 0.406: v83.82,55.88 E11.9 | v21.59,63.5 19.05,60.96 19.05,59.05 18.42,58.42 8.26,58.42 U$2.AV1
  Bottom 0.406: v83.82,55.88 76.2,63.5 v21.59,63.5
N$76  (via drill 0.81)
  Top 0.406: E11.13 83.82,40.64 v83.82,29.84 | v16.51,25.4 14.61,23.5 8.26,23.5 U$2.AH1
  Bottom 0.406: v83.82,29.84 79.38,25.4 v16.51,25.4
N$77
  Bottom 0.406: E9.5 60.33,50.8 56.52,54.61 45.09,54.61 41.28,58.42 20.96,58.42 17.78,55.24 8.26,55.24 U$2.AU2
N$78
  Top 0.406: E11.1 95.25,39.37 95.25,19.68 94.62,19.05 87.63,19.05 87.63,4.45 85.09,1.91 16.51,1.91 16.51,14.61 14.61,16.51 8.26,16.51 U$2.AE1
N$79  (via drill 0.81)
  Top 0.406: v17.15,66.04 16.51,66.67 16.51,73.03 15.88,73.66 8.26,73.66 U$2.BA1
  Bottom 0.406: E11.5 91.44,53.34 88.27,53.34 87,54.61 81.92,54.61 75.57,60.96 46.99,60.96 45.72,62.23 20.96,62.23 v17.15,66.04
N$81
  Bottom 0.406: E21.12 74.93,118.11 82.55,118.11 E22.9 87.63,123.19 97.79,123.19 E23.10
N$83
  Top 0.406: 85.09,114.3 E22.12 E22.13 | 85.09,114.3 E21.3 | E22.8 85.09,123.19 85.09,114.3
N$84
  Top 0.406: E20.9 E20.10 | C26.2 48.26,119.38 R2.2 D1.C
  Bottom 0.406: C26.2 E20.9
N$85
  Bottom 0.406: E20.13 62.23,118.11 67.95,118.11 70.49,120.65 77.47,120.65 E21.6
N$86
  Top 0.406: R3.2 43.18,114.3 C27.2 | E19.13 E19.12 24.13,115.57 24.13,118.11 E19.10 E19.9
  Bottom 0.406: R3.2 36.83,115.57 26.67,115.57 E19.12
N$87
  Top 0.406: R1.1 45.72,111.76 C26.1
  Bottom 0.406: E20.11 54.61,118.11 46.99,118.11 C26.1
N$89
  Top 0.406: E20.12 54.61,114.3 | 54.61,114.3 R3.1 | E20.8 54.61,123.19 54.61,114.3
OVERFLOW
  Top 0.406: E23.5 110.49,120.65 110.49,125.09 107.32,128.27 17.78,128.27 17.78,121.28 15.24,118.75 8.26,118.75 U$2.BS1
SET_COUNT  (via drill 0.81)
  Top 0.406: E23.13 102.87,110.49 102.87,90.17 E18.10 | E19.6 36.83,118.11 36.83,99.69 41.91,94.61 41.91,90.17 E14.10 | v15.88,91.44 15.88,92.71 8.26,92.71 U$2.BH1
  Bottom 0.406: E18.4 104.14,86.36 E18.10 96.52,88.9 E17.4 91.44,88.9 E17.10 81.28,88.9 E16.4 76.2,88.9 E16.10 66.04,88.9 E15.4 60.96,88.9 E15.10 54.61,87.63 46.99,87.63 | 46.99,87.63 45.72,88.9 E14.10 35.56,88.9 E13.4 30.48,88.9 E13.10 18.42,88.9 v15.88,91.44 | 46.99,87.63 E14.4
TRANSFER
  Top 0.406: E19.8 22.86,121.92 22.86,73.03 24.13,71.75 24.13,59.05 22.86,57.78 22.86,13.34 24.77,11.43 26.67,11.43 26.67,13.97 E1.11
  Bottom 0.406: E6.3 106.68,15.24 E6.11 99.06,12.7 E5.3 91.44,15.24 E5.11 83.82,12.7 E4.3 76.2,15.24 E4.11 68.58,12.7 E3.3 60.96,15.24 E3.11 53.34,12.7 E2.3 45.72,15.24 E2.11 38.1,12.7 E1.3 30.48,15.24 E1.11 24.13,16.51 8.26,16.51 U$2.AE2
VCC  (via drill 0.81)
  Top 0.813: E6.14 C6.1 | E5.14 C5.1 | C4.1 E4.14 76.2,12.7 C24.+ C10.1 E10.14 | E3.14 C3.1 | E2.14 C2.1 | E1.14 C1.1 | E20.14 C20.1 | E19.14 C19.1 | C27.1 R1.2 | E23.14 C23.1 | E22.14 C22.1 | E21.14 C21.1 C25.+ 74.93,100.33 v74.93,82.55 | E16.14 C16.1 | E15.14 C15.1 | E14.14 C14.1 | E13.14 C13.1 | E9.14 C9.1 | E7.14 C7.1 | E8.14 C8.1 | E17.14 C17.1 | E18.14 C18.1 104.14,73.66 104.14,43.18 E12.14 C12.1 | E11.14 C11.1
  Bottom 0.813: C1.1 24.77,4.45 8.26,4.45 U$2.AA2 | C2.1 40.01,5.71 31.75,5.71 29.85,7.62 E1.14 | C3.1 55.25,5.71 46.99,5.71 45.09,7.62 E2.14 | C4.1 70.49,5.71 62.23,5.71 60.33,7.62 E3.14 | C5.1 85.73,5.71 77.47,5.71 75.57,7.62 E4.14 | C6.1 100.97,5.71 92.71,5.71 90.81,7.62 E5.14 | C19.1 28.58,106.68 30.48,108.58 31.75,108.58 33.02,107.31 36.2,107.31 | R1.2 36.2,107.31 | C20.1 55.25,107.31 36.2,107.31 | 84.46,104.78 81.28,101.6 C25.+ | 84.46,104.78 C22.1 | C23.1 99.7,104.78 84.46,104.78 | E20.14 56.52,108.58 62.23,108.58 64.14,106.68 C21.1 | 23.5,74.3 C13.1 | 23.5,74.3 8.26,74.3 U$2.BA2 | 38.74,74.3 C14.1 | 23.5,74.3 38.74,74.3 | C15.1 53.98,74.3 38.74,74.3 | 63.5,76.2 62.87,76.2 60.33,78.74 E15.14 | 63.5,76.2 C16.1 | C7.1 27.31,36.2 38.74,36.2 C8.1 | C9.1 55.25,38.73 46.99,38.73 45.09,40.64 E8.14 | E17.14 87,78.11 92.71,78.11 93.98,76.83 | 93.98,76.83 95.25,75.56 100.97,75.56 C18.1 | 84.46,36.2 81.28,33.02 C24.+ | 84.46,36.2 C11.1 | C12.1 99.7,36.2 84.46,36.2 | E9.14 56.52,40.01 62.23,40.01 63.5,38.73 70.49,38.73 C10.1 | 63.5,76.2 63.5,71.75 88.9,71.75 93.98,76.83 | E16.14 v74.93,82.55

### Text on the board
Bottom: Clock Counter M709B
tDocu: Component and trace layout does not match.